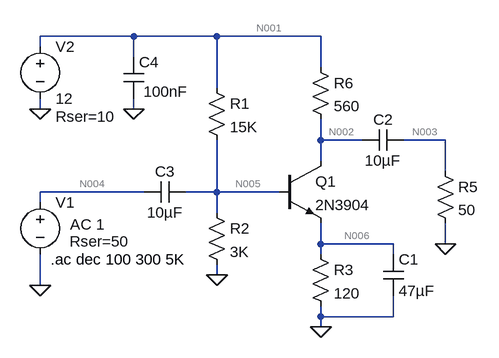
[diagram p0: schematic 2n3904_Mic_amp.asc]
2n3904_Mic_amp.asc, the LTspice schematic file:
Version 4
SHEET 1 976 740
WIRE -16 112 -160 112
WIRE 112 112 -16 112
WIRE 272 112 112 112
WIRE -160 128 -160 112
WIRE -16 144 -16 112
WIRE 272 160 272 112
WIRE 112 192 112 112
WIRE -160 224 -160 208
WIRE -16 224 -16 208
WIRE 272 272 272 240
WIRE 336 272 272 272
WIRE 464 272 400 272
WIRE 272 304 272 272
WIRE 464 320 464 272
WIRE 0 352 -160 352
WIRE 112 352 112 272
WIRE 112 352 64 352
WIRE 208 352 112 352
WIRE -160 368 -160 352
WIRE 112 384 112 352
WIRE 272 432 272 400
WIRE 384 432 272 432
WIRE 464 432 464 400
WIRE 272 448 272 432
WIRE 384 448 384 432
WIRE 112 480 112 464
WIRE -160 496 -160 448
WIRE 272 544 272 528
WIRE 384 544 384 512
WIRE 384 544 272 544
WIRE 272 560 272 544
FLAG -160 496 0
FLAG 112 480 0
FLAG 272 560 0
FLAG -16 224 0
FLAG 464 432 0
FLAG -160 224 0
SYMBOL voltage -160 352 R0
WINDOW 123 46 50 Left 2
WINDOW 39 45 76 Left 2
SYMATTR Value2 AC 1
SYMATTR SpiceLine Rser=50
SYMATTR InstName V1
SYMATTR Value ""
SYMBOL res 96 176 R0
SYMATTR InstName R1
SYMATTR Value 15K
SYMBOL res 96 368 R0
SYMATTR InstName R2
SYMATTR Value 3K
SYMBOL res 256 432 R0
SYMATTR InstName R3
SYMATTR Value 120
SYMBOL npn 208 304 R0
SYMATTR InstName Q1
SYMATTR Value 2N3904
SYMBOL cap 64 336 R90
WINDOW 0 0 32 VBottom 2
WINDOW 3 32 32 VTop 2
SYMATTR InstName C3
SYMATTR Value 10µF
SYMBOL cap -32 144 R0
WINDOW 3 31 53 Left 2
SYMATTR Value 100nF
SYMATTR InstName C4
SYMBOL res 448 304 R0
SYMATTR InstName R5
SYMATTR Value 50
SYMBOL voltage -160 112 R0
WINDOW 123 0 0 Left 0
WINDOW 39 24 124 Left 2
SYMATTR SpiceLine Rser=10
SYMATTR InstName V2
SYMATTR Value 12
SYMBOL cap 368 448 R0
SYMATTR InstName C1
SYMATTR Value 47µF
SYMBOL res 256 144 R0
SYMATTR InstName R6
SYMATTR Value 560
SYMBOL cap 400 256 R90
WINDOW 0 0 32 VBottom 2
WINDOW 3 32 32 VTop 2
SYMATTR InstName C2
SYMATTR Value 10µF
TEXT -144 456 Left 2 !.ac dec 100 300 5K

The netlist it stands for:
* 2n3904_Mic_amp.asc
V1 N004 0 AC 1 Rser=50
R1 N001 N005 15K
R2 N005 0 3K
R3 N006 0 120
Q1 N002 N005 N006 0 2N3904
C3 N005 N004 10µF
C4 N001 0 100nF
R5 N003 0 50
V2 N001 0 12 Rser=10
C1 N006 0 47µF
R6 N001 N002 560
C2 N003 N002 10µF
.model NPN NPN
.model PNP PNP
.lib standard.bjt
.ac dec 100 300 5K
.backanno
.end

* Results of the author's LTspice run, read from the files saved beside the schematic
* Operating Point, zero values left out:
*   V(n001) = 11.89 V
*   V(n005) = 1.902 V
*   V(n006) = 1.187 V
*   V(n002) = 6.375 V
*   Ic(Q1) = 9.856 mA
*   Ib(Q1) = 32.19 µA
*   Ie(Q1) = -9.888 mA
*   I(R6) = 9.856 mA
*   I(R3) = 9.888 mA
*   I(R2) = 634 µA
*   I(R1) = 666.2 µA
*   I(V2) = -10.52 mA
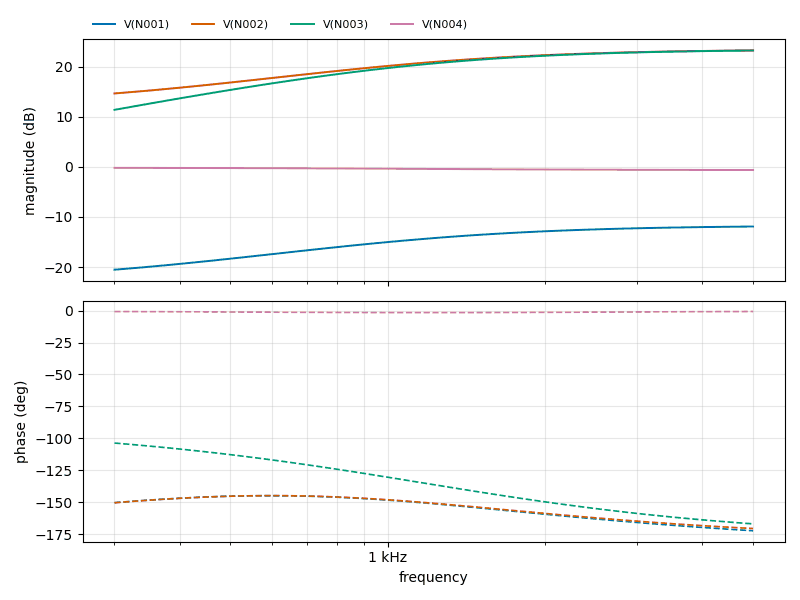
[diagram p1: AC Analysis of 2n3904_Mic_amp.asc, plotted from the saved traces]
* AC Analysis, 1 run:
*   V(N001): -20.53 dB at 300 Hz, -11.92 dB at 5 kHz, peak -11.92 dB at 5 kHz, 3 dB below the peak at 1.023 kHz
*   V(N002): 14.64 dB at 300 Hz, 23.23 dB at 5 kHz, peak 23.23 dB at 5 kHz, 3 dB below the peak at 1.022 kHz
*   V(N003): 11.37 dB at 300 Hz, 23.21 dB at 5 kHz, peak 23.21 dB at 5 kHz, 3 dB below the peak at 1.109 kHz
*   V(N004): -0.21 dB at 300 Hz, -0.64 dB at 5 kHz, peak -0.21 dB at 300 Hz